# Altium schematic sheet LOOM - LV BOX.SchDoc
size 594 x 420 mm
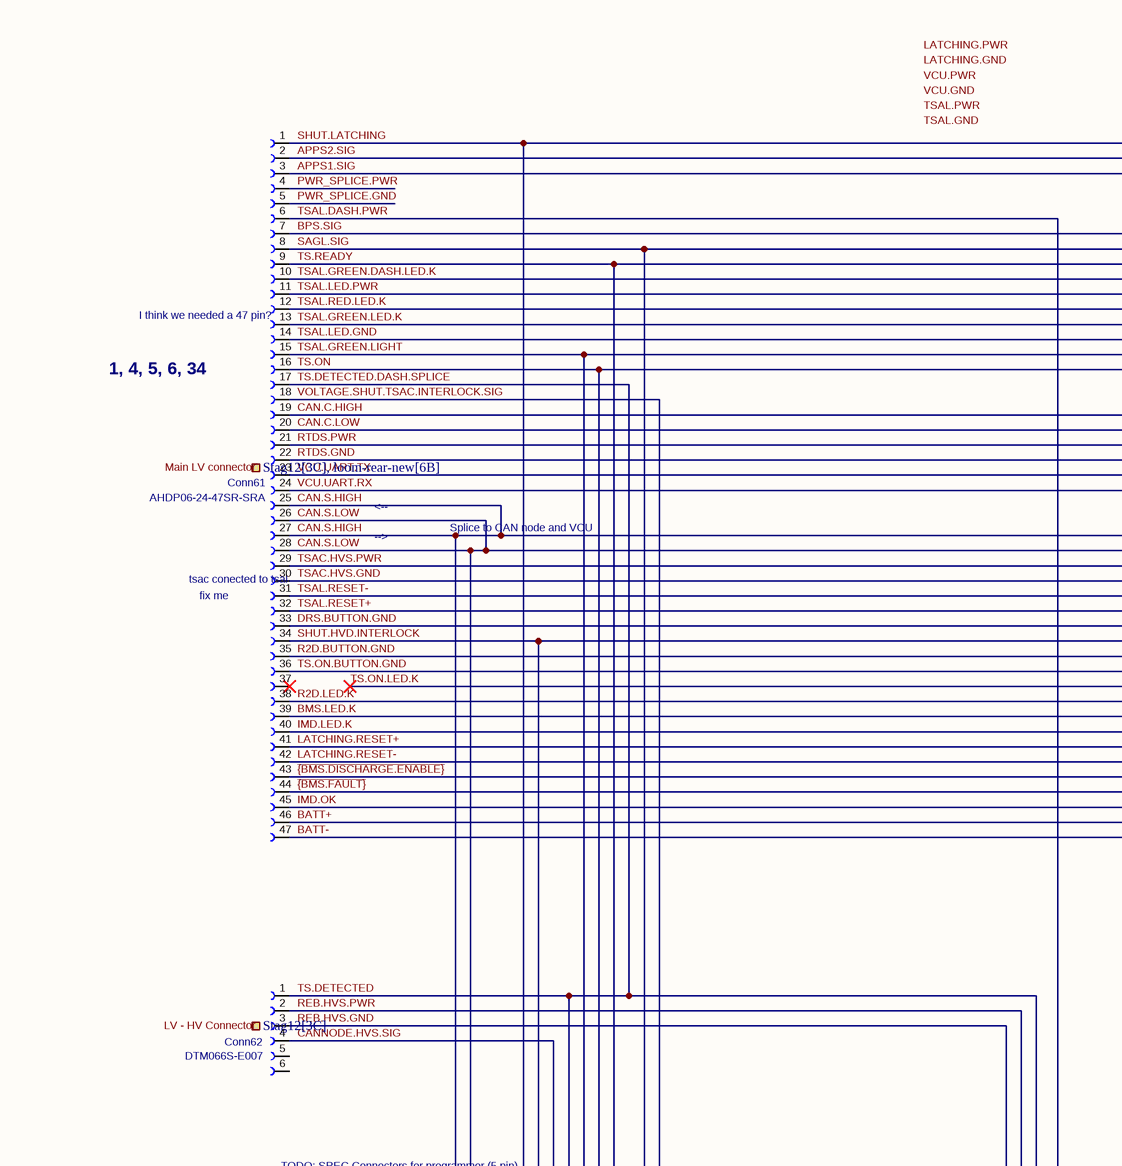
[diagram p0: LOOM - LV BOX.SchDoc, top left]
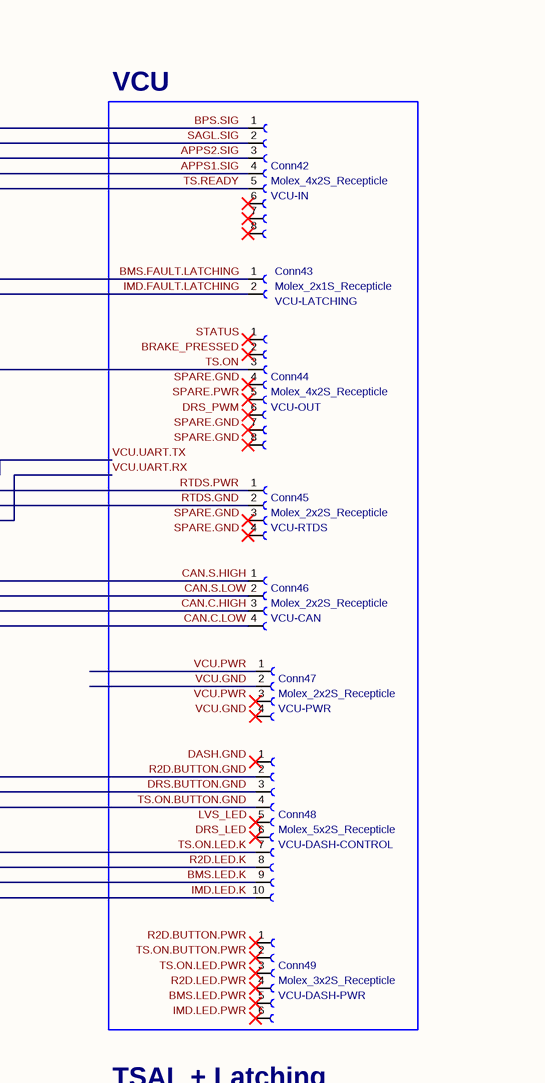
[diagram p1: LOOM - LV BOX.SchDoc, top right]
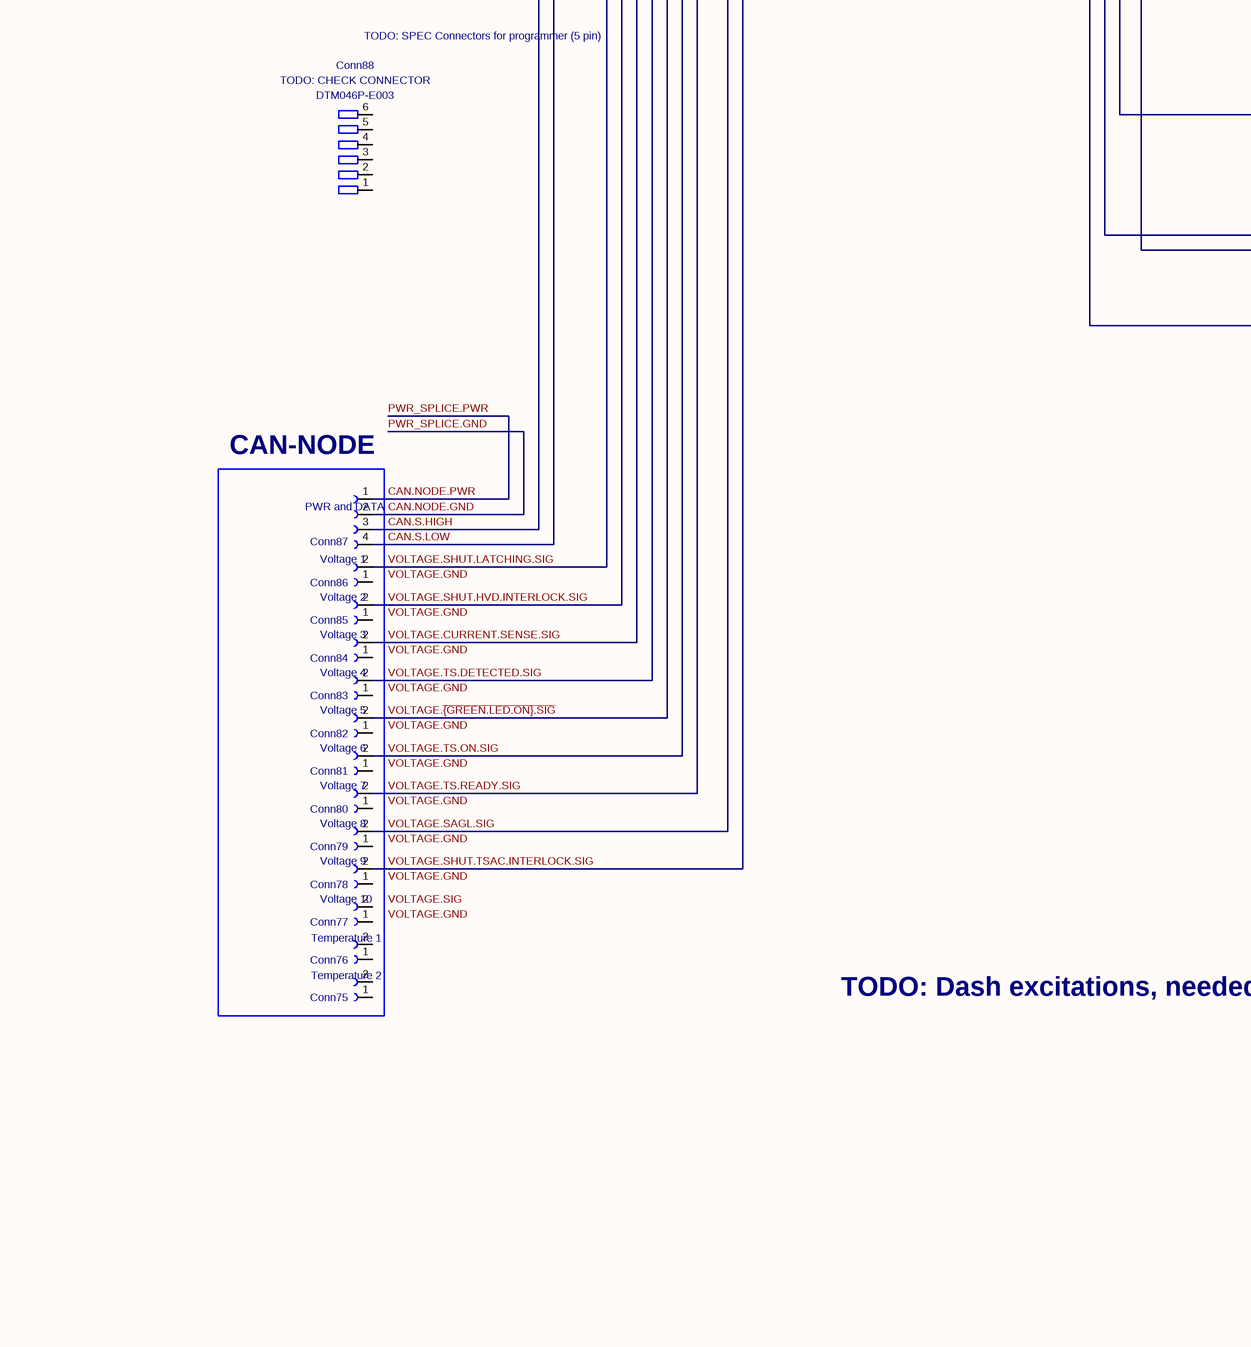
[diagram p2: LOOM - LV BOX.SchDoc, bottom left]
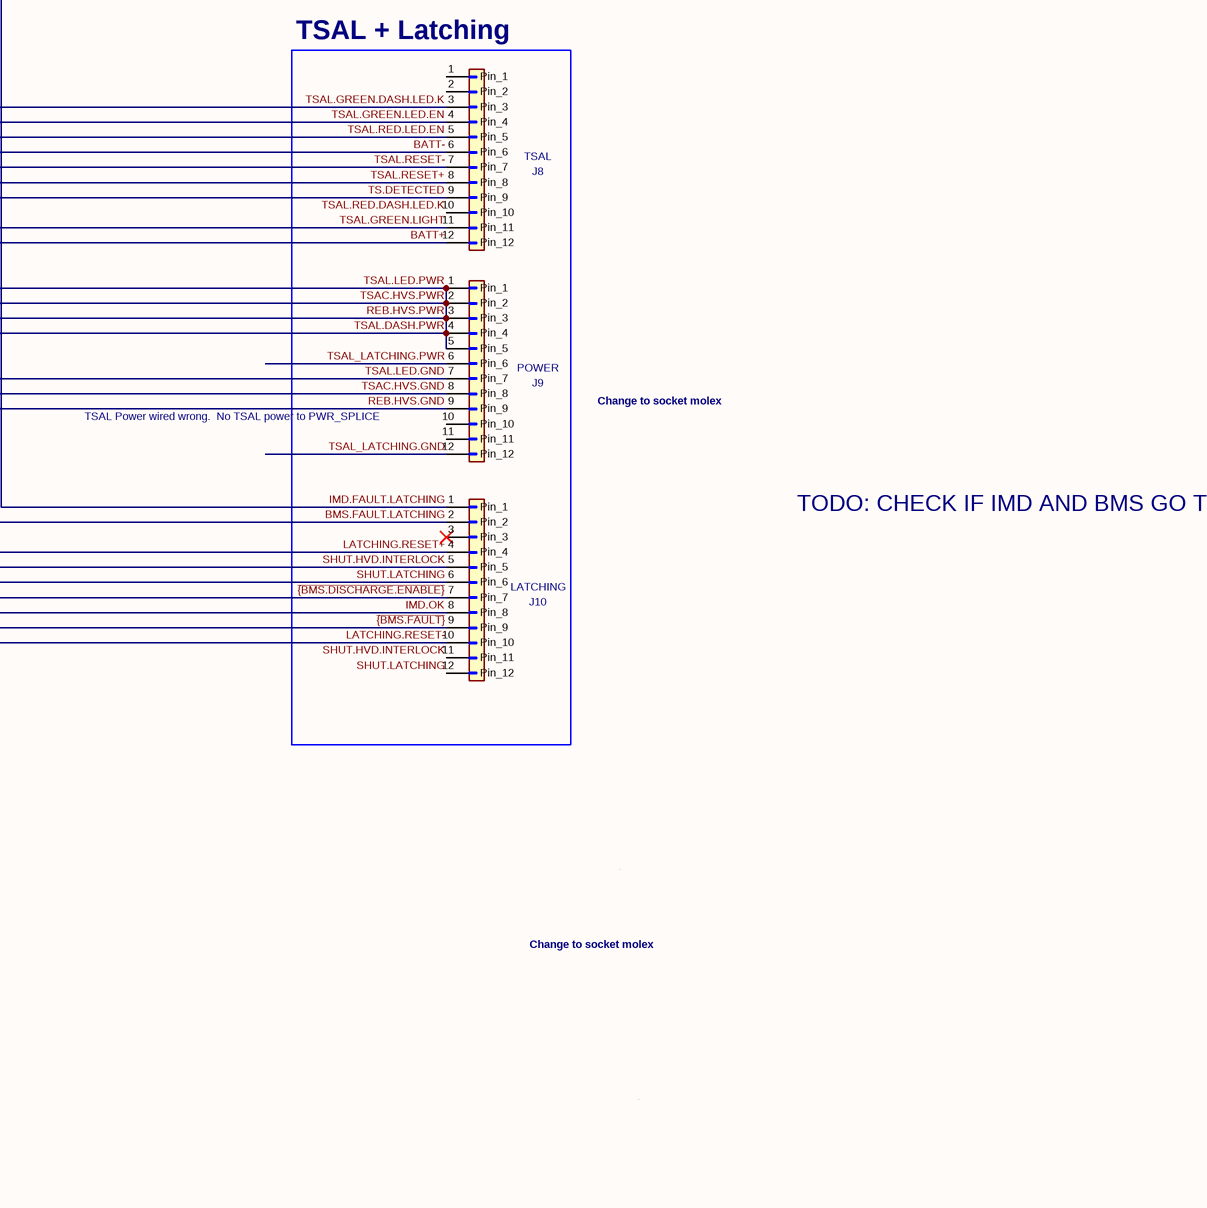
[diagram p3: LOOM - LV BOX.SchDoc, bottom right]

## Parts
Conn42  Conn Name: VCU-IN  (hidden comment: Molex_4x2S_Recepticle)
Conn43  Conn Name: VCU-LATCHING  (hidden comment: Molex_2x1S_Recepticle)
Conn44  Conn Name: VCU-OUT  (hidden comment: Molex_4x2S_Recepticle)
Conn45  Conn Name: VCU-RTDS  (hidden comment: Molex_2x2S_Recepticle)
Conn46  Conn Name: VCU-CAN  (hidden comment: Molex_2x2S_Recepticle)
Conn47  Conn Name: VCU-PWR  (hidden comment: Molex_2x2S_Recepticle)
Conn48  Conn Name: VCU-DASH-CONTROL  (hidden comment: Molex_5x2S_Recepticle)
Conn49  Conn Name: VCU-DASH-PWR  (hidden comment: Molex_3x2S_Recepticle)
Conn61  P/N: AHDP06-24-47SR-SRA  (hidden comment: AMPHENOL-47P-Recepticle)
Conn62  P/N: DTM066S-E007  (hidden comment: Deutsch_DTM_12S_Pin)
Conn75  Molex_2x1S_Recepticle  (value not drawn)
Conn76  Molex_2x1S_Recepticle  (value not drawn)
Conn77  Molex_2x1S_Recepticle  (value not drawn)
Conn78  Molex_2x1S_Recepticle  (value not drawn)
Conn79  Molex_2x1S_Recepticle  (value not drawn)
Conn80  Molex_2x1S_Recepticle  (value not drawn)
Conn81  Molex_2x1S_Recepticle  (value not drawn)
Conn82  Molex_2x1S_Recepticle  (value not drawn)
Conn83  Molex_2x1S_Recepticle  (value not drawn)
Conn84  Molex_2x1S_Recepticle  (value not drawn)
Conn85  Molex_2x1S_Recepticle  (value not drawn)
Conn86  Molex_2x1S_Recepticle  (value not drawn)
Conn87  Molex_4x1S_Recepticle  (value not drawn)
Conn88  P/N: DTM046P-E003  (hidden comment: TODO: CHECK CONNECTOR)
J8  TSAL  [Molex_Micro-Fit_3.0_43045-1200_2x06_P3.00mm_Horizontal]
J9  POWER  [Molex_Micro-Fit_3.0_43045-1200_2x06_P3.00mm_Horizontal]
J10  LATCHING  [Molex_Micro-Fit_3.0_43045-1200_2x06_P3.00mm_Horizontal]

## Blocks framed on the sheet
VCU: Conn42-Conn49
TSAL + Latching: J8-J10
CAN-NODE: Conn75-Conn87

## Ports
LV - HV Connector (in, see Stag12[3C]), Main LV connector (in, see Stag12[3C], loom-rear-new[6B])

## Nets
APPS1.SIG: Conn42.4 Conn61.3
APPS2.SIG: Conn42.3 Conn61.2
BATT+: Conn61.46 J8.12(Pin_12)
BATT-: Conn61.47 J8.6(Pin_6)
BMS.FAULT.LATCHING: Conn43.1 J10.2(Pin_2)
BMS.LED.K: Conn48.9 Conn61.39
BPS.SIG: Conn42.1 Conn61.7
CAN.C.HIGH: Conn46.3 Conn61.19
CAN.C.LOW: Conn46.4 Conn61.20
CAN.NODE.GND: Conn61.5 Conn87.2  [also labelled PWR_SPLICE.GND]
CAN.NODE.PWR: Conn61.4 Conn87.1  [also labelled PWR_SPLICE.PWR]
CAN.S.HIGH: Conn46.1 Conn61.25 Conn61.27 Conn87.3
CAN.S.LOW: Conn46.2 Conn61.26 Conn61.28 Conn87.4
CANNODE.HVS.SIG: Conn62.4 Conn84.2  [also labelled VOLTAGE.CURRENT.SENSE.SIG]
DRS.BUTTON.GND: Conn48.3 Conn61.33
IMD.FAULT.LATCHING: Conn43.2 J10.1(Pin_1)
IMD.LED.K: Conn48.10 Conn61.40
IMD.OK: Conn61.45 J10.8(Pin_8)
LATCHING.RESET+: Conn61.41 J10.4(Pin_4)
LATCHING.RESET-: Conn61.42 J10.10(Pin_10)
R2D.BUTTON.GND: Conn48.2 Conn61.35
R2D.LED.K: Conn48.8 Conn61.38
REB.HVS.GND: Conn62.3 J9.9(Pin_9)
REB.HVS.PWR: Conn61.6 Conn61.11 Conn61.29 Conn62.2 J9.1(Pin_1) J9.2(Pin_2) J9.3(Pin_3) J9.4(Pin_4) J9.5(Pin_5)  [also labelled TSAC.HVS.PWR, TSAL.DASH.PWR, TSAL.LED.PWR]
RTDS.GND: Conn45.2 Conn61.22
RTDS.PWR: Conn45.1 Conn61.21
SAGL.SIG: Conn42.2 Conn61.8 Conn79.2  [also labelled VOLTAGE.SAGL.SIG]
SHUT.HVD.INTERLOCK: Conn61.34 Conn85.2 J10.5(Pin_5) J10.11(Pin_11)  [also labelled VOLTAGE.SHUT.HVD.INTERLOCK.SIG]
SHUT.LATCHING: Conn61.1 Conn86.2 J10.6(Pin_6) J10.12(Pin_12)  [also labelled VOLTAGE.SHUT.LATCHING.SIG]
TS.DETECTED: Conn61.17 Conn62.1 Conn83.2 J8.9(Pin_9)  [also labelled TS.DETECTED.DASH.SPLICE, VOLTAGE.TS.DETECTED.SIG]
TS.ON: Conn44.3 Conn61.16 Conn81.2  [also labelled VOLTAGE.TS.ON.SIG]
TS.ON.BUTTON.GND: Conn48.4 Conn61.36
TS.ON.LED.K: Conn48.7
TS.READY: Conn42.5 Conn61.9 Conn80.2  [also labelled VOLTAGE.TS.READY.SIG]
TSAC.HVS.GND: Conn61.30 J9.8(Pin_8)
TSAL.GREEN.DASH.LED.K: Conn61.10 J8.3(Pin_3)
TSAL.GREEN.LED.EN: Conn61.13 J8.4(Pin_4)  [also labelled TSAL.GREEN.LED.K]
TSAL.GREEN.LIGHT: Conn61.15 Conn82.2 J8.11(Pin_11)  [also labelled VOLTAGE.~{{GREEN.LED.ON}.SIG}]
TSAL.LED.GND: Conn61.14 J9.7(Pin_7)
TSAL.RED.DASH.LED.K: J8.10(Pin_10)
TSAL.RED.LED.EN: Conn61.12 J8.5(Pin_5)  [also labelled TSAL.RED.LED.K]
TSAL.RESET+: Conn61.32 J8.8(Pin_8)
TSAL.RESET-: Conn61.31 J8.7(Pin_7)
TSAL_LATCHING.GND: J9.12(Pin_12)
TSAL_LATCHING.PWR: J9.6(Pin_6)
VCU.GND: Conn47.2
VCU.PWR: Conn47.1
VCU.UART.RX: Conn61.24
VCU.UART.TX: Conn61.23
VOLTAGE.SHUT.TSAC.INTERLOCK.SIG: Conn61.18 Conn78.2
~{{BMS.DISCHARGE.ENABLE}}: Conn61.43 J10.7(Pin_7)
~{{BMS.FAULT}}: Conn61.44 J10.9(Pin_9)

Not connected (* = marked no-connect by the designer): Conn42 6* 7* 8*; Conn44 1* 2* 4* 5* 6* 7* 8*; Conn45 3* 4*; Conn47 3* 4*; Conn48 1* 5* 6*; Conn49 1* 2* 3* 4* 5* 6*; Conn61 37*; Conn62 5 6; Conn75 1 2; Conn76 1 2; Conn77 1 2; Conn78 1; Conn79 1; Conn80 1; Conn81 1; Conn82 1; Conn83 1; Conn84 1; Conn85 1; Conn86 1; Conn88 1 2 3 4 5 6; J8 1(Pin_1) 2(Pin_2); J9 10(Pin_10) 11(Pin_11); J10 3(Pin_3)*

## Notes on the sheet
- (near Conn61) I think we needed a 47 pin?
- (near Conn61) 1, 4, 5, 6, 34
- (near Conn61) tsac conected to tsal
- -->
- <--
- Splice to CAN node and VCU
- (near Conn61) fix me
- TODO: SPEC Connectors for programmer (5 pin)
- TSAL Power
  wired wrong.
  No TSAL power
  to PWR_SPLICE
- Change to socket molex
- TODO: CHECK IF IMD AND BMS GO TO DASH OR VCU
- (near Conn87) PWR and DATA
- (near Conn86) Voltage 1
- (near Conn84) Voltage 3
- (near Conn85) Voltage 2
- (near Conn82) Voltage 5
- (near Conn83) Voltage 4
- (near Conn81) Voltage 6
- (near Conn80) Voltage 7
- (near Conn78) Voltage 9
- (near Conn79) Voltage 8
- (near Conn76) Temperature 1
- (near Conn77) Voltage 10
- (near Conn75) Temperature 2
- TODO:
  Dash excitations, needed or no?
  Dash soft reset
  Maybe combine some EXC signals, not sure
- Labels drawn without touching a wire or pin: BMS.LED.PWR, BRAKE_PRESSED, DASH.GND, DRS_LED, DRS_PWM, IMD.LED.PWR, LATCHING.GND, LATCHING.PWR, LVS_LED, R2D.BUTTON.PWR, R2D.LED.PWR, SPARE.GND, SPARE.PWR, STATUS, TS.ON.BUTTON.PWR, TS.ON.LED.PWR, TSAL.GND, TSAL.PWR, VCU.GND, VCU.PWR, VOLTAGE.GND, VOLTAGE.SIG
- 1
- 2
- 3
- 4
- 5
- 6
- 7
- 8
- 9
- 10
- 11
- A
- B
- C
- D
- E
- F
- G
- H
- Title:
- File: LOOM - LV BOX.kicad_sch
- Sheet: /
- KiCad E.D.A.  kicad (5.1.4)-1
- Size: A2
- Date:
- Rev:
- Id: 1/1

## Library data of the parts
Conn42 Conn44 = Molex_4x2S_Recepticle: P/N: 43025-0800; Value: Molex_4x2S_Recepticle
Conn43 Conn75-Conn86 = Molex_2x1S_Recepticle: P/N: 43645-0200; Value: Molex_2x1S_Recepticle
Conn45-Conn47 = Molex_2x2S_Recepticle: P/N: 43025-0400; Value: Molex_2x2S_Recepticle
Conn48 = Molex_5x2S_Recepticle: P/N: 43025-1000; Value: Molex_5x2S_Recepticle
Conn49 = Molex_3x2S_Recepticle: P/N: 43025-0600; Value: Molex_3x2S_Recepticle
Conn62 = Deutsch_DTM_6S_Pin: Value: Deutsch_DTM_12S_Pin
Conn87 = Molex_4x1S_Recepticle: P/N: 43645-0400; Value: Molex_4x1S_Recepticle
Conn88 = Deutsch_DTM_6P_Pin: Value: TODO: CHECK CONNECTOR
J8-J10 = Conn_01x12: Footprint: Connector_Molex:Molex_Micro-Fit_3.0_43045-1200_2x06_P3.00mm_Horizontal
  J8: Value: TSAL
  J9: Value: POWER
  J10: Value: LATCHING
Conn61 = AMPHENOL-47P-Recepticle: Value: AMPHENOL-47P-Recepticle